# EAGLE schematic SchedaRobotica (EAGLE 9.6.2)
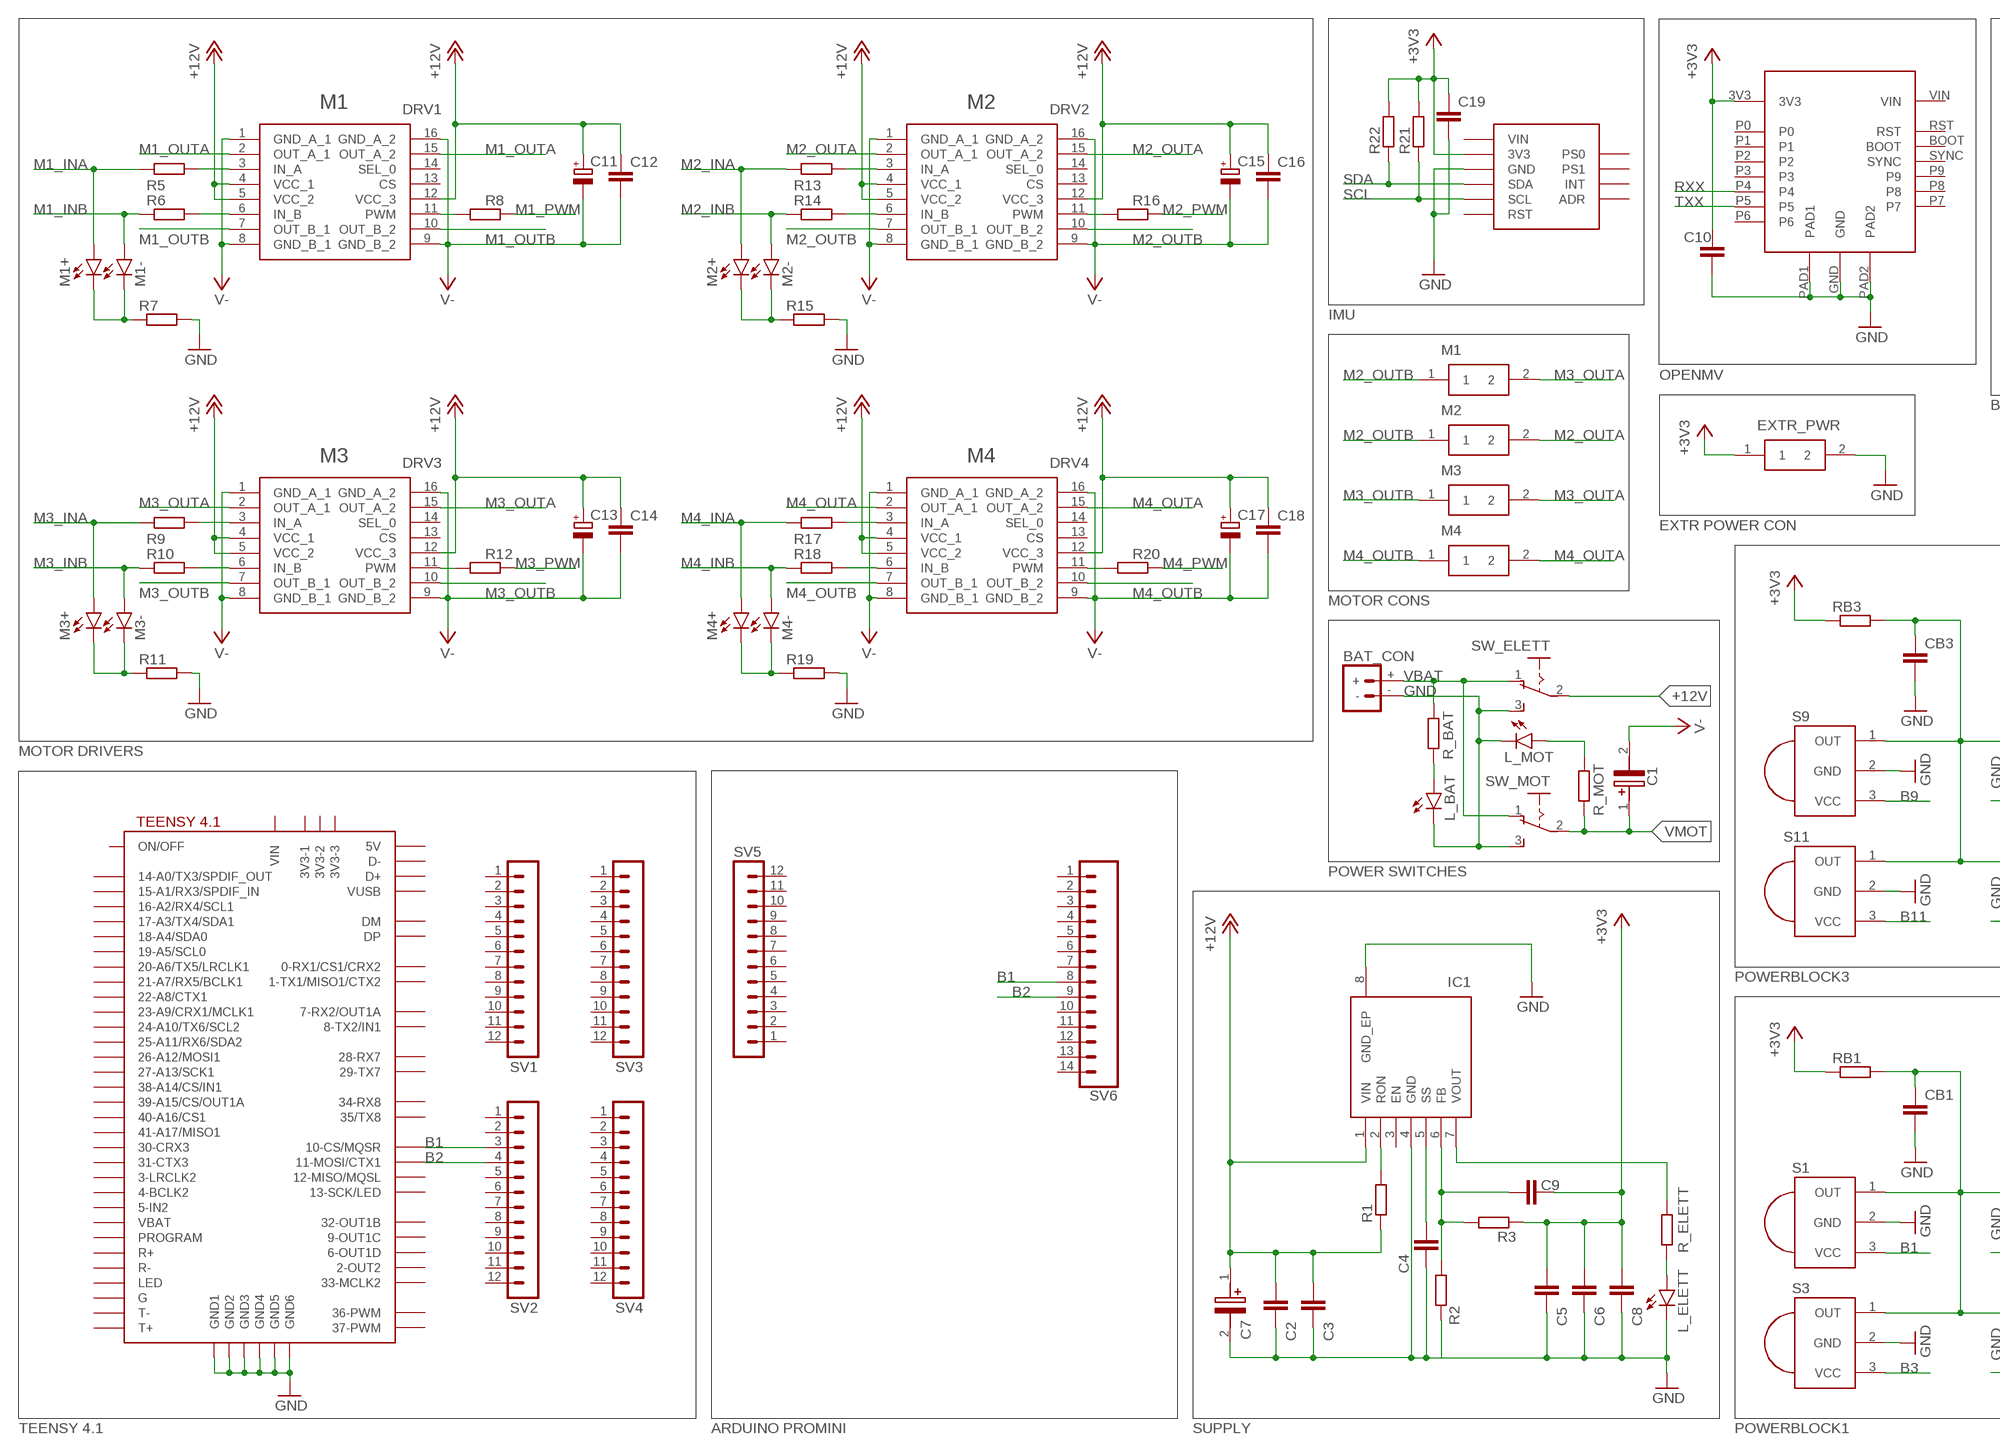
[diagram p0: schematic, sheet 1, part 1 of 2]
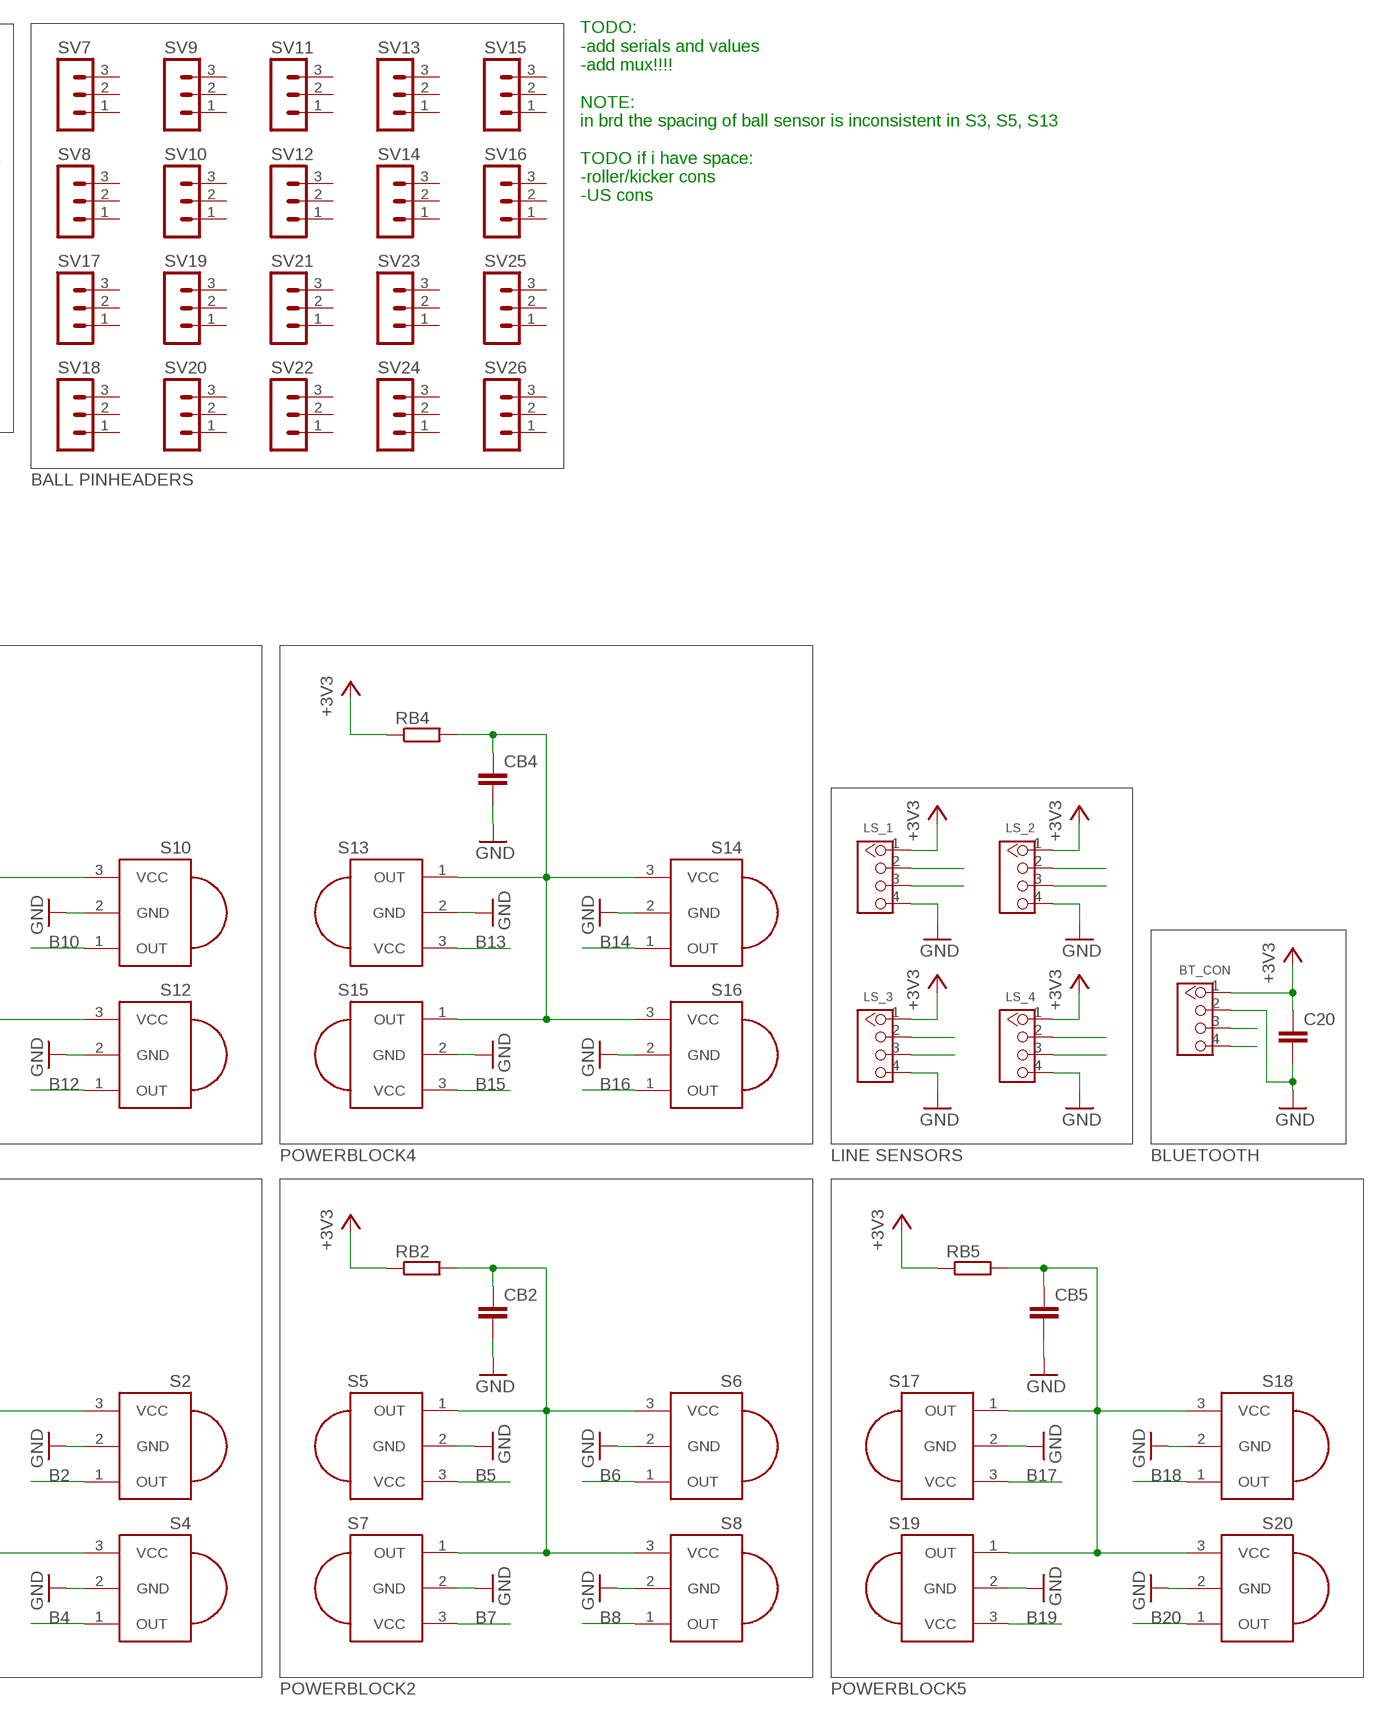
[diagram p1: schematic, sheet 1, part 2 of 2]

## Parts
BAT_CON  BATTERY_CONN_DEANS  [DEANS]
BT_CON  4P-2.0  GROVE-CONNECTOR-DIP(4P-2.0)  [HW4-2.0]
C1  EEV-FK1C152Q  [FKV(H13)]
C2  100n  C-EUC0805  [C0805]
C3  100n  C-EUC0805  [C0805]
C4  22n  C-EUC0805  [C0805]
C5  100u  C-EUC1206  [C1206]
C6  100u  C-EUC1206  [C1206]
C7  EEV-FK1C152Q  [FKV(H13)]
C8  100n  C-EUC0805  [C0805]
C9  22n  C-EUC0805  [C0805]
C10  100u  C-EUC1206  [C1206]
C11  CPOL-EUE  [PANASONIC_E]
C12  C-EUC0805  [C0805]
C13  CPOL-EUE  [PANASONIC_E]
C14  C-EUC0805  [C0805]
C15  CPOL-EUE  [PANASONIC_E]
C16  C-EUC0805  [C0805]
C17  CPOL-EUE  [PANASONIC_E]
C18  C-EUC0805  [C0805]
C19  1u  C-EUC0805  [C0805]
C20  1u  C-EUC0805  [C0805]
CB1  C-EUC0805  [C0805]
CB2  C-EUC0805  [C0805]
CB3  C-EUC0805  [C0805]
CB4  C-EUC0805  [C0805]
CB5  C-EUC0805  [C0805]
DRV1  VNH7070ASTR  [SOIC127P600X175-16N]
DRV2  VNH7070ASTR  [SOIC127P600X175-16N]
DRV3  VNH7070ASTR  [SOIC127P600X175-16N]
DRV4  VNH7070ASTR  [SOIC127P600X175-16N]
EXTR_PWR  43650-0201  [43650-0200]
IC1  LMZ14202TZE-ADJ_NOPB  [NDW0007A]
L_BAT  LEDCHIPLED_1206  [CHIPLED_1206]
L_ELETT  LEDCHIPLED_1206  [CHIPLED_1206]
L_MOT  LEDCHIPLED_1206  [CHIPLED_1206]
LS_1  4P-2.0  GROVE-CONNECTOR-DIP(4P-2.0)  [HW4-2.0]
LS_2  4P-2.0  GROVE-CONNECTOR-DIP(4P-2.0)  [HW4-2.0]
LS_3  4P-2.0  GROVE-CONNECTOR-DIP(4P-2.0)  [HW4-2.0]
LS_4  4P-2.0  GROVE-CONNECTOR-DIP(4P-2.0)  [HW4-2.0]
M1  43650-0201  [43650-0200]
M1+  LEDCHIPLED_1206  [CHIPLED_1206]
M1-  LEDCHIPLED_1206  [CHIPLED_1206]
M2  43650-0201  [43650-0200]
M2+  LEDCHIPLED_1206  [CHIPLED_1206]
M2-  LEDCHIPLED_1206  [CHIPLED_1206]
M3  43650-0201  [43650-0200]
M3+  LEDCHIPLED_1206  [CHIPLED_1206]
M3-  LEDCHIPLED_1206  [CHIPLED_1206]
M4  43650-0201  [43650-0200]
M4+  LEDCHIPLED_1206  [CHIPLED_1206]
M4-  LEDCHIPLED_1206  [CHIPLED_1206]
R1  61,9k  R-EU_M0805  [M0805]
R2  1,07k  R-EU_M0805  [M0805]
R3  3,32k  R-EU_M0805  [M0805]
R5  R-EU_M0805  [M0805]
R6  R-EU_M0805  [M0805]
R7  R-EU_M0805  [M0805]
R8  R-EU_M0805  [M0805]
R9  R-EU_M0805  [M0805]
R10  R-EU_M0805  [M0805]
R11  R-EU_M0805  [M0805]
R12  R-EU_M0805  [M0805]
R13  R-EU_M0805  [M0805]
R14  R-EU_M0805  [M0805]
R15  R-EU_M0805  [M0805]
R16  R-EU_M0805  [M0805]
R17  R-EU_M0805  [M0805]
R18  R-EU_M0805  [M0805]
R19  R-EU_M0805  [M0805]
R20  R-EU_M0805  [M0805]
R21  10k  R-EU_M0805  [M0805]
R22  10k  R-EU_M0805  [M0805]
R_BAT  R-EU_M0805  [M0805]
R_ELETT  R-EU_M0805  [M0805]
R_MOT  R-EU_M0805  [M0805]
RB1  R-EU_M0805  [M0805]
RB2  R-EU_M0805  [M0805]
RB3  R-EU_M0805  [M0805]
RB4  R-EU_M0805  [M0805]
RB5  R-EU_M0805  [M0805]
S1  PNA460XM  [PNA460XM]
S2  PNA460XM  [PNA460XM]
S3  PNA460XM  [PNA460XM]
S4  PNA460XM  [PNA460XM]
S5  PNA460XM  [PNA460XM]
S6  PNA460XM  [PNA460XM]
S7  PNA460XM  [PNA460XM]
S8  PNA460XM  [PNA460XM]
S9  PNA460XM  [PNA460XM]
S10  PNA460XM  [PNA460XM]
S11  PNA460XM  [PNA460XM]
S12  PNA460XM  [PNA460XM]
S13  PNA460XM  [PNA460XM]
S14  PNA460XM  [PNA460XM]
S15  PNA460XM  [PNA460XM]
S16  PNA460XM  [PNA460XM]
S17  PNA460XM  [PNA460XM]
S18  PNA460XM  [PNA460XM]
S19  PNA460XM  [PNA460XM]
S20  PNA460XM  [PNA460XM]
SV1  MA12-1  [MA12-1]
SV2  MA12-1  [MA12-1]
SV3  MA12-1  [MA12-1]
SV4  MA12-1  [MA12-1]
SV5  MA12-1  [MA12-1]
SV6  CONN_14LONGPADS  [1X14-LONGPADS]
SV7  MA03-1  [MA03-1]
SV8  MA03-1  [MA03-1]
SV9  MA03-1  [MA03-1]
SV10  MA03-1  [MA03-1]
SV11  MA03-1  [MA03-1]
SV12  MA03-1  [MA03-1]
SV13  MA03-1  [MA03-1]
SV14  MA03-1  [MA03-1]
SV15  MA03-1  [MA03-1]
SV16  MA03-1  [MA03-1]
SV17  MA03-1  [MA03-1]
SV18  MA03-1  [MA03-1]
SV19  MA03-1  [MA03-1]
SV20  MA03-1  [MA03-1]
SV21  MA03-1  [MA03-1]
SV22  MA03-1  [MA03-1]
SV23  MA03-1  [MA03-1]
SV24  MA03-1  [MA03-1]
SV25  MA03-1  [MA03-1]
SV26  MA03-1  [MA03-1]
SW_ELETT  255SB  [255SB]
SW_MOT  255SB  [255SB]
U$1  TEENSY41  [TEENSY41]
U$2  OPENMV_H7  [OPENMV_H7]
U$3  BNO055_BNO055  [BNO055_BNO055]

## Nets
+3V3: BT_CON.1 C5.1 C6.1 C8.1 C9.2 C10.1 C19.1 C20.1 EXTR_PWR.1 LS_1.1 LS_2.1 LS_3.1 LS_4.1 R3.1 R21.2 R22.2 RB1.1 RB2.1 RB3.1 RB4.1 RB5.1 U$2.3V3 U$3.3V3
+12V: C2.1 C3.1 C7.1(+) C11.+ C12.1 C13.+ C14.1 C15.+ C16.1 C17.+ C18.1 DRV1.4(VCC_1) DRV1.5(VCC_2) DRV1.12(VCC_3) DRV2.4(VCC_1) DRV2.5(VCC_2) DRV2.12(VCC_3) DRV3.4(VCC_1) DRV3.5(VCC_2) DRV3.12(VCC_3) DRV4.4(VCC_1) DRV4.5(VCC_2) DRV4.12(VCC_3) IC1.1(VIN) R1.1 SW_ELETT.2(P)
B1: S1.3(VCC) SV2.3 SV6.8 U$1.10-CS\MQSR(10-CS/MQSR)
B2: S2.1(OUT) SV2.4 SV6.9 U$1.11-MOSI/CTX1
B3: S3.3(VCC)
B4: S4.1(OUT)
B5: S5.3(VCC)
B6: S6.1(OUT)
B7: S7.3(VCC)
B8: S8.1(OUT)
B9: S9.3(VCC)
B10: S10.1(OUT)
B11: S11.3(VCC)
B12: S12.1(OUT)
B13: S13.3(VCC)
B14: S14.1(OUT)
B15: S15.3(VCC)
B16: S16.1(OUT)
B17: S17.3(VCC)
B18: S18.1(OUT)
B19: S19.3(VCC)
B20: S20.1(OUT)
GND: BAT_CON.- BT_CON.2 C2.2 C3.2 C4.2 C5.2 C6.2 C7.2(-) C8.2 C10.2 C19.2 C20.2 CB1.2 CB2.2 CB3.2 CB4.2 CB5.2 EXTR_PWR.2 IC1.4(GND) IC1.8(GND_EP) L_BAT.C L_ELETT.C L_MOT.C LS_1.4 LS_2.4 LS_3.4 LS_4.4 R2.1 R7.2 R11.2 R15.2 R19.2 S1.2(GND) S2.2(GND) S3.2(GND) S4.2(GND) S5.2(GND) S6.2(GND) S7.2(GND) S8.2(GND) S9.2(GND) S10.2(GND) S11.2(GND) S12.2(GND) S13.2(GND) S14.2(GND) S15.2(GND) S16.2(GND) S17.2(GND) S18.2(GND) S19.2(GND) S20.2(GND) SW_ELETT.3(S) SW_MOT.3(S) U$1.GND1 U$1.GND2 U$1.GND3 U$1.GND4 U$1.GND5 U$1.GND6 U$2.GND U$2.PAD1 U$2.PAD2 U$3.GND
IFE: BT_CON.3
M1_INA: M1+.A R5.1
M1_INB: M1-.A R6.1
M1_OUTA: DRV1.2(OUT_A_1) DRV1.15(OUT_A_2)
M1_OUTB: DRV1.7(OUT_B_1) DRV1.10(OUT_B_2)
M1_PWM: R8.2
M2_INA: M2+.A R13.1
M2_INB: M2-.A R14.1
M2_OUTA: DRV2.2(OUT_A_1) DRV2.15(OUT_A_2) M2.2
M2_OUTB: DRV2.7(OUT_B_1) DRV2.10(OUT_B_2) M1.1 M2.1
M2_PWM: R16.2
M3_INA: M3+.A R9.1
M3_INB: M3-.A R10.1
M3_OUTA: DRV3.2(OUT_A_1) DRV3.15(OUT_A_2) M1.2 M3.2
M3_OUTB: DRV3.7(OUT_B_1) DRV3.10(OUT_B_2) M3.1
M3_PWM: R12.2
M4_INA: M4+.A R17.1
M4_INB: M4-.A R18.1
M4_OUTA: DRV4.2(OUT_A_1) DRV4.15(OUT_A_2) M4.2
M4_OUTB: DRV4.7(OUT_B_1) DRV4.10(OUT_B_2) M4.1
M4_PWM: R20.2
N$1: CB2.1 RB2.2 S5.1(OUT) S6.3(VCC) S7.1(OUT) S8.3(VCC)
N$2: CB1.1 RB1.2 S1.1(OUT) S2.3(VCC) S3.1(OUT) S4.3(VCC)
N$3: CB3.1 RB3.2 S9.1(OUT) S10.3(VCC) S11.1(OUT) S12.3(VCC)
N$4: CB4.1 RB4.2 S13.1(OUT) S14.3(VCC) S15.1(OUT) S16.3(VCC)
N$5: CB5.1 RB5.2 S17.1(OUT) S18.3(VCC) S19.1(OUT) S20.3(VCC)
N$6: C4.1 IC1.5(SS)
N$7: L_BAT.A R_BAT.2
N$8: LS_3.2
N$9: L_MOT.A R_MOT.1
N$10: C9.1 IC1.6(FB) R2.2 R3.2
N$11: IC1.2(RON) R1.2
N$12: L_ELETT.A R_ELETT.1
N$13: LS_3.3
N$14: IC1.7(VOUT) R_ELETT.2
N$15: LS_1.2
N$16: LS_1.3
N$17: LS_2.2
N$18: LS_2.3
N$19: LS_4.2
N$20: LS_4.3
N$21: M1+.C M1-.C R7.1
N$22: DRV1.3(IN_A) R5.2
N$23: DRV1.6(IN_B) R6.2
N$24: DRV1.11(PWM) R8.1
N$25: DRV3.3(IN_A) R9.2
N$26: DRV3.6(IN_B) R10.2
N$27: M3+.C M3-.C R11.1
N$28: DRV3.11(PWM) R12.1
N$29: DRV2.3(IN_A) R13.2
N$30: DRV2.6(IN_B) R14.2
N$31: M2+.C M2-.C R15.1
N$32: DRV2.11(PWM) R16.1
N$33: DRV4.3(IN_A) R17.2
N$34: DRV4.6(IN_B) R18.2
N$35: M4+.C M4-.C R19.1
N$36: DRV4.11(PWM) R20.1
N$39: BT_CON.4
RXX: U$2.P4
SCL: R21.1 U$3.SCL
SDA: R22.1 U$3.SDA
TXX: U$2.P5
V-: C1.2(-) C11.- C12.2 C13.- C14.2 C15.- C16.2 C17.- C18.2 DRV1.1(GND_A_1) DRV1.8(GND_B_1) DRV1.9(GND_B_2) DRV1.16(GND_A_2) DRV2.1(GND_A_1) DRV2.8(GND_B_1) DRV2.9(GND_B_2) DRV2.16(GND_A_2) DRV3.1(GND_A_1) DRV3.8(GND_B_1) DRV3.9(GND_B_2) DRV3.16(GND_A_2) DRV4.1(GND_A_1) DRV4.8(GND_B_1) DRV4.9(GND_B_2) DRV4.16(GND_A_2)
VBAT: BAT_CON.+ R_BAT.1 SW_ELETT.1(O) SW_MOT.1(O)
VMOT: C1.1(+) R_MOT.2 SW_MOT.2(P)
Unconnected: DRV1.13(CS) DRV1.14(SEL_0) DRV2.13(CS) DRV2.14(SEL_0) DRV3.13(CS) DRV3.14(SEL_0) DRV4.13(CS) DRV4.14(SEL_0) IC1.3(EN) SV1.1 SV1.2 SV1.3 SV1.4 SV1.5 SV1.6 SV1.7 SV1.8 SV1.9 SV1.10 SV1.11 SV1.12 SV2.1 SV2.2 SV2.5 SV2.6 SV2.7 SV2.8 SV2.9 SV2.10 SV2.11 SV2.12 SV3.1 SV3.2 SV3.3 SV3.4 SV3.5 SV3.6 SV3.7 SV3.8 SV3.9 SV3.10 SV3.11 SV3.12 SV4.1 SV4.2 SV4.3 SV4.4 SV4.5 SV4.6 SV4.7 SV4.8 SV4.9 SV4.10 SV4.11 SV4.12 SV5.1 SV5.2 SV5.3 SV5.4 SV5.5 SV5.6 SV5.7 SV5.8 SV5.9 SV5.10 SV5.11 SV5.12 SV6.1 SV6.2 SV6.3 SV6.4 SV6.5 SV6.6 SV6.7 SV6.10 SV6.11 SV6.12 SV6.13 SV6.14 SV7.1 SV7.2 SV7.3 SV8.1 SV8.2 SV8.3 SV9.1 SV9.2 SV9.3 SV10.1 SV10.2 SV10.3 SV11.1 SV11.2 SV11.3 SV12.1 SV12.2 SV12.3 SV13.1 SV13.2 SV13.3 SV14.1 SV14.2 SV14.3 SV15.1 SV15.2 SV15.3 SV16.1 SV16.2 SV16.3 SV17.1 SV17.2 SV17.3 SV18.1 SV18.2 SV18.3 SV19.1 SV19.2 SV19.3 SV20.1 SV20.2 SV20.3 SV21.1 SV21.2 SV21.3 SV22.1 SV22.2 SV22.3 SV23.1 SV23.2 SV23.3 SV24.1 SV24.2 SV24.3 SV25.1 SV25.2 SV25.3 SV26.1 SV26.2 SV26.3 U$1.0-RX1/CS1/CRX2 U$1.1-TX1/MISO1/CTX2 U$1.2-OUT2 U$1.3-LRCLK2 U$1.3V3-1 U$1.3V3-2 U$1.3V3-3 U$1.4-BCLK2 U$1.5-IN2 U$1.6-OUT1D U$1.7-RX2/OUT1A U$1.8-TX2/IN2(8-TX2/IN1) U$1.9-OUT1C U$1.12-MISO/MQSL U$1.13-SCK/LED U$1.14-A0/TX3/SPDIF_OUT U$1.15-A1/RX3/SPDIF_IN U$1.16-A2/RX4/SCL1 U$1.17-A3/TX4/SDA1 U$1.18-A4/SDA0 U$1.19-A5/SCL0 U$1.20-A6/TX5/LRCLK1 U$1.21-A7/RX5/BCLK1 U$1.22-A8/CTX1 U$1.23-A9/CRX1/MCLK1 U$1.24-A10/TX6/SCL2 U$1.25-A11/RX6/SDA2 U$1.26-A12/MOSI1 U$1.27-A13/SCK1 U$1.28-RX7 U$1.29-TX7 U$1.30-CRX3 U$1.31-CTX3 U$1.32-OUT1B U$1.33-MCLK2 U$1.34-RX8 U$1.35-TX8(35/TX8) U$1.36-PWM U$1.37-PWM U$1.38-A14/CS/IN1 U$1.39-A15/CS/OUT1A U$1.40-A16/CS1 U$1.41-A17/MISO1 U$1.+5V(5V) U$1.D+ U$1.D- U$1.DM U$1.DP U$1.G U$1.LED U$1.ON/OFF U$1.PROGRAM U$1.R+ U$1.R- U$1.T+ U$1.T- U$1.VBAT U$1.VIN U$1.VUSB U$2.BOOT U$2.P0 U$2.P1 U$2.P2 U$2.P3 U$2.P6 U$2.P7 U$2.P8 U$2.P9 U$2.RST U$2.SYNC U$2.VIN U$3.ADR U$3.INT U$3.PS0 U$3.PS1 U$3.RST U$3.VIN

## Notes on the sheet
- M1 | M2
- TODO:
  -add serials and values
  -add mux!!!!
  
  NOTE:
  in brd the spacing of ball sensor is inconsistent in S3, S5, S13
  
  TODO if i have space:
  -roller/kicker cons
  -US cons
- IMU
- OPENMV
- BALL PINHEADERS
- M3 | M4
- EXTR POWER CON
- MOTOR CONS
- MOTOR DRIVERS
- POWER SWITCHES
- POWERBLOCK3 | POWERBLOCK4 | LINE SENSORS | BLUETOOTH
- TEENSY 4.1 | ARDUINO PROMINI | SUPPLY | POWERBLOCK1 | POWERBLOCK2 | POWERBLOCK5

## Library data of the parts
BAT_CON = SparkFun-Connectors:BATTERY_CONN: Battery Connectors Various footprints for battery connections SparkFun Products: Deans Connector -M/F Pair <https://www.sparkfun.com/products/11864>; SF_ID: PRT-11864
BT_CON LS_1-LS_4 = OPL_Connector:GROVE-CONNECTOR-DIP(4P-2.0): 320110033
C1 C7 = Panasonic 1500uF:EEV-FK1C152Q: PANASONIC ELECTRONIC COMPONENTS - EEV-FK1C152Q - ALUMINUM ELECTROLYTIC CAPACITOR, 1500UF, 16V, 20%, SMD, FULL REEL Source: Datasheet <https://industrial.panasonic.com/cdbs/www-data/pdf/RDE0000/ABA0000C1181.pdf>; ALLIED_NUMBER: 70258729; ALLIED_PRICE-STOCK: https://www.alliedelec.com/panasonic-eev-fk1c152q/70258729/; DESCRIPTION: PANASONIC ELECTRONIC COMPONENTS - EEV-FK1C152Q - ALUMINUM ELECTROLYTIC CAPACITOR, 1500UF, 16V, 20%, SMD, FULL REEL; HEIGHT: mm; MANUFACTURER_NAME: Panasonic; MANUFACTURER_PART_NUMBER: EEV-FK1C152Q; MOUSER_PART_NUMBER: 667-EEV-FK1C152Q; MOUSER_PRICE-STOCK: https://www.mouser.com/Search/Refine.aspx?Keyword=667-EEV-FK1C152Q
C2-C6 C8-C10 C12 C14 C16 C18-C20 CB1-CB5 = rcl:C-EU: CAPACITOR, European symbol; SPICEPREFIX: C
C11 C13 C15 C17 = rcl:CPOL-EU: POLARIZED CAPACITOR, European symbol; SPICEPREFIX: C
DRV1-DRV4 = VNH7070AS:VNH7070ASTR: Motor / Motion / Ignition Controllers & Drivers Source: Datasheet <http://www.st.com/content/ccc/resource/technical/document/datasheet/08/97/0a/0c/cf/4b/41/40/DM00213876.pdf/files/DM00213876.pdf/jcr:content/translations/en.DM00213876.pdf>; DESCRIPTION: Motor / Motion / Ignition Controllers & Drivers; HEIGHT: 1.75mm; MANUFACTURER_NAME: STMicroelectronics; MANUFACTURER_PART_NUMBER: VNH7070ASTR; MOUSER_PART_NUMBER: 511-VNH7070ASTR; MOUSER_PRICE-STOCK: https://www.mouser.com/Search/Refine.aspx?Keyword=511-VNH7070ASTR; RS_PART_NUMBER: 1647017P; RS_PRICE-STOCK: http://uk.rs-online.com/web/p/products/1647017P
EXTR_PWR M1-M4 = Molex motori:43650-0201: MOLEX - 43650-0201 - PLUG & SOCKET CONNECTOR, HEADER 2POS 3MM Source: Datasheet <https://www.molex.com/pdm_docs/sd/436500201_sd.pdf>; ALLIED_NUMBER: 70090754; ALLIED_PRICE-STOCK: https://www.alliedelec.com/molex-incorporated-43650-0201/70090754/; DESCRIPTION: MOLEX - 43650-0201 - PLUG & SOCKET CONNECTOR, HEADER 2POS 3MM; HEIGHT: mm; MANUFACTURER_NAME: Molex; MANUFACTURER_PART_NUMBER: 43650-0201; MOUSER_PART_NUMBER: 538-43650-0201; MOUSER_PRICE-STOCK: https://www.mouser.com/Search/Refine.aspx?Keyword=538-43650-0201
IC1 = LMZ14202TZE:LMZ14202TZE-ADJ_NOPB: Voltage Regulators - Switching Regulators 2A pwr Module w/ 42V Max Input Vtg Source: Datasheet <http://www.ti.com/lit/ds/symlink/lmz14202.pdf>; DESCRIPTION: Voltage Regulators - Switching Regulators 2A pwr Module w/ 42V Max Input Vtg; HEIGHT: mm; MANUFACTURER_NAME: Texas Instruments; MANUFACTURER_PART_NUMBER: LMZ14202TZE-ADJ/NOPB; MOUSER_PART_NUMBER: 926-LM14202TZEADJNPB; MOUSER_PRICE-STOCK: https://www.mouser.com/Search/Refine.aspx?Keyword=926-LM14202TZEADJNPB; RS_PART_NUMBER: 7981195P; RS_PRICE-STOCK: http://uk.rs-online.com/web/p/products/7981195P
L_BAT L_ELETT L_MOT M1+ M1- M2+ M2- M3+ M3- M4+ M4- = led:LED: LED OSRAM: - CHIPLED LG R971, LG N971, LY N971, LG Q971, LY Q971, LO R971, LY R971 LH N974, LH R974 LS Q976, LO Q976, LY Q976 LO Q996 - Hyper CHIPLED LW Q18S LB Q993, LB Q99A, LB R99A - SideLED LS A670, LO A670, LY A670, LG A670, LP A670 LB A673, LV A673, LT A673, LW A673 LH A674 LY A675 LS A676, LA A676, LO A676, LY A676, LW A676 LS A679, LY A679, LG A679 - Hyper Micro SIDELED® LS Y876, LA Y876, LO Y876, LY Y876 LT Y87S - SmartLED LW L88C, LW L88S LB L89C, LB L89S, LG L890 LS L89K, LO L89K, LY L89K LS L896, LA L896, LO L896, LY L896 - TOPLED LS T670, LO T670, LY T670, LG T670, LP T670 LSG T670, LSP T670, LSY T670, LOP T670, LYG T670 LG T671, LOG T671, LSG T671 LB T673, LV T673, LT T673, LW T673 LH T674 LS T676, LA T676, LO T676, LY T676, LB T676, LH T676, LSB T676, LW T676 LB T67C, LV T67C, LT T67C, LS T67K, LO T67K, LY T67K, LW E67C LS E67B, LA E67B, LO E67B, LY E67B, LB E67C, LV E67C, LT E67C LW T67C LS T679, LY T679, LG T679 LS T770, LO T770, LY T770, LG T770, LP T770 LB T773, LV T773, LT T773, LW T773 LH T774 LS E675, LA E675, LY E675, LS T675 LS T776, LA T776, LO T776, LY T776, LB T776 LHGB T686 LT T68C, LB T68C - Hyper Mini TOPLED® LB M676 - Mini TOPLED Santana® LG M470 LS M47K, LO M47K, LY M47K Source: http://www.osram.convergy.de LUXEON: - LUMILED® LXK2-PW12-R00, LXK2-PW12-S00, LXK2-PW14-U00, LXK2-PW14-V00 LXK2-PM12-R00, LXK2-PM12-S00, LXK2-PM14-U00 LXK2-PE12-Q00, LXK2-PE12-R00, LXK2-PE12-S00, LXK2-PE14-T00, LXK2-PE14-U00 LXK2-PB12-K00, LXK2-PB12-L00, LXK2-PB12-M00, LXK2-PB14-N00, LXK2-PB14-P00, LXK2-PB14-Q00 LXK2-PR12-L00, LXK2-PR12-M00, LXK2-PR14-Q00, LXK2-PR14-R00 LXK2-PD12-Q00, LXK2-PD12-R00, LXK2-PD12-S00 LXK2-PH12-R00, LXK2-PH12-S00 LXK2-PL12-P00, LXK2-PL12-Q00, LXK2-PL12-R00 Source: www.luxeon.com KINGBRIGHT: KA-3528ASYC Source: www.kingbright.com
R1-R3 R5-R22 R_BAT R_ELETT R_MOT RB1-RB5 = rcl:R-EU_: RESISTOR, European symbol; SPICEPREFIX: R
S1-S20 = adafruit:PNA460XM: IR 38KHz receiver PNA4602 and related receivers http://www.ladyada.net/library/pcb/eaglelibrary.html
SV1-SV5 = con-lstb:MA12-1: PIN HEADER; OC_FARNELL: unknown; OC_NEWARK: unknown
SV6 = SparkFun-Connectors:CONN_14: Multi connection point. Often used as Generic Header-pin footprint for 0.1 inch spaced/style header connections On any of the 0.1 inch spaced packages, you can populate with these: Break Away Headers - Straight <https://www.sparkfun.com/products/116> (PRT-00116) Break Away Male Headers - Right Angle <https://www.sparkfun.com/products/553> (PRT-00553) Female Headers <https://www.sparkfun.com/products/115> (PRT-00115) Break Away Headers - Machine Pin <https://www.sparkfun.com/products/117> (PRT-00117) Break Away Female Headers - Swiss Machine Pin <https://www.sparkfun.com/products/743> (PRT-00743) For SCREWTERMINALS and SPRING TERMINALS visit here: Screw Terimnals on SparkFun.com <https://www.sparkfun.com/search/results?term=Screw+Terminals> (5mm/3.5mm/2.54mm spacing) This device is also useful as a general connection point to wire up your design to another part of your project. Our various solder wires solder well into these plated through hole pads. Hook-Up Wire - Assortment (Stranded, 22 AWG) <https://www.sparkfun.com/products/11375> (PRT-11375) Hook-Up Wire - Assortment (Solid Core, 22 AWG) <https://www.sparkfun.com/products/11367> (PRT-11367) View the entire wire category on our website here <https://www.sparkfun.com/categories/141> Special notes: Molex polarized connector foot print use with SKU : PRT-08231 with associated crimp pins and housings. 1MM SMD Version SKU: PRT-10208 NOTES ON THE VARIANTS LOCK and LOCK_LONGPADS... This footprint was designed to help hold the alignment of a through-hole component (i.e. 6-pin header) while soldering it into place. You may notice that each hole has been shifted either up or down by 0.005 of an inch from it's more standard position (which is a perfectly straight line). This slight alteration caused the pins (the squares in the middle) to touch the edges of the holes. Because they are alternating, it causes a "brace" to hold the component in place. 0.005 has proven to be the perfect amount of "off-center" position when using our standard breakaway headers. Although looks a little odd when you look at the bare footprint, once you have a header in there, the alteration is very hard to notice. Also,if you push a header all the way into place, it is covered up entirely on the bottom side.
SV7-SV26 = con-lstb:MA03-1: PIN HEADER; OC_FARNELL: unknown; OC_NEWARK: unknown
SW_ELETT SW_MOT = switch_modified:255SB: SLIDING SWITCH Distributor Buerklin, 11G810
U$1 = teensy:TEENSY41
U$2 = OpenMV:OPENMV_H7
U$3 = IMU:BNO055_BNO055